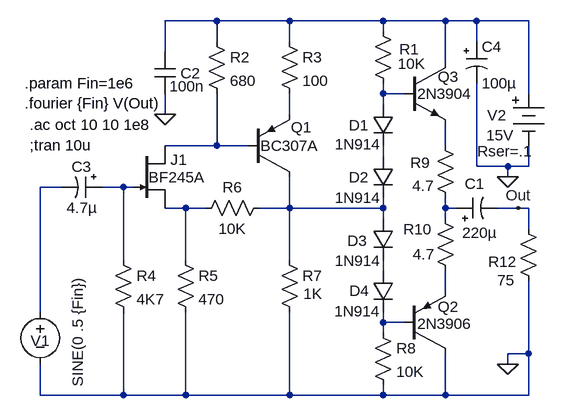
[diagram p0: schematic PwrVidAmp.asc]
PwrVidAmp.asc, the LTspice schematic file:
Version 4
SHEET 1 880 680
WIRE -272 480 -272 288
WIRE -272 608 -272 560
WIRE -240 288 -272 288
WIRE -144 288 -176 288
WIRE -144 400 -144 288
WIRE -144 608 -272 608
WIRE -144 608 -144 480
WIRE -128 288 -144 288
WIRE -80 80 -80 32
WIRE -80 176 -80 144
WIRE -48 320 -80 320
WIRE -48 400 -48 320
WIRE -48 608 -144 608
WIRE -48 608 -48 480
WIRE -16 320 -48 320
WIRE 0 32 -80 32
WIRE 0 64 0 32
WIRE 0 224 -80 224
WIRE 0 224 0 144
WIRE 48 224 0 224
WIRE 112 32 0 32
WIRE 112 64 112 32
WIRE 112 176 112 144
WIRE 112 320 64 320
WIRE 112 320 112 272
WIRE 112 400 112 320
WIRE 112 608 -48 608
WIRE 112 608 112 480
WIRE 256 32 112 32
WIRE 256 48 256 32
WIRE 256 144 256 128
WIRE 256 160 256 144
WIRE 256 240 256 224
WIRE 256 320 112 320
WIRE 256 320 256 304
WIRE 256 336 256 320
WIRE 256 416 256 400
WIRE 256 496 256 480
WIRE 256 512 256 496
WIRE 256 608 112 608
WIRE 256 608 256 592
WIRE 288 144 256 144
WIRE 288 496 256 496
WIRE 352 32 256 32
WIRE 352 96 352 32
WIRE 352 224 352 192
WIRE 352 320 352 304
WIRE 352 336 352 320
WIRE 352 448 352 416
WIRE 352 608 256 608
WIRE 352 608 352 544
WIRE 368 320 352 320
WIRE 400 32 352 32
WIRE 400 64 400 32
WIRE 400 256 400 128
WIRE 448 256 400 256
WIRE 448 272 448 256
WIRE 448 560 448 544
WIRE 464 320 432 320
WIRE 480 32 400 32
WIRE 480 144 480 32
WIRE 480 256 448 256
WIRE 480 256 480 224
WIRE 480 320 464 320
WIRE 480 352 480 320
WIRE 480 544 448 544
WIRE 480 544 480 432
WIRE 480 608 352 608
WIRE 480 608 480 544
FLAG 448 560 0
FLAG -80 176 0
FLAG 464 320 Out
FLAG 448 272 0
SYMBOL njf -128 224 R0
WINDOW 0 57 22 Left 0
WINDOW 3 23 49 Left 0
SYMATTR InstName J1
SYMATTR Value BF245A
SYMBOL pnp2 48 272 M180
WINDOW 0 66 76 Left 0
WINDOW 3 19 48 Left 0
SYMATTR InstName Q1
SYMATTR Value BC307A
SYMBOL pnp2 288 544 M180
WINDOW 0 52 72 Left 0
WINDOW 3 21 46 Left 0
SYMATTR InstName Q2
SYMATTR Value 2N3906
SYMBOL npn2 288 96 R0
WINDOW 0 52 22 Left 0
WINDOW 3 21 48 Left 0
SYMATTR InstName Q3
SYMATTR Value 2N3904
SYMBOL diode 240 160 R0
WINDOW 0 -37 33 Left 0
WINDOW 3 -58 62 Left 0
SYMATTR InstName D1
SYMATTR Value 1N914
SYMBOL res 240 32 R0
WINDOW 0 41 44 Left 0
WINDOW 3 39 66 Left 0
SYMATTR InstName R1
SYMATTR Value 10K
SYMATTR SpiceLine tol=1 pwr=0.1
SYMBOL res -16 48 R0
SYMATTR InstName R2
SYMATTR Value 680
SYMATTR SpiceLine tol=1 pwr=0.1
SYMBOL res 96 48 R0
SYMATTR InstName R3
SYMATTR Value 100
SYMATTR SpiceLine tol=1 pwr=0.1
SYMBOL res -160 384 R0
SYMATTR InstName R4
SYMATTR Value 4K7
SYMATTR SpiceLine tol=1 pwr=0.1
SYMBOL res -64 384 R0
SYMATTR InstName R5
SYMATTR Value 470
SYMATTR SpiceLine tol=1 pwr=0.1
SYMBOL res 80 304 R90
WINDOW 0 0 56 VBottom 0
WINDOW 3 32 56 VTop 0
SYMATTR InstName R6
SYMATTR Value 10K
SYMATTR SpiceLine tol=1 pwr=0.1
SYMBOL res 96 384 R0
WINDOW 3 37 68 Left 0
SYMATTR Value 1K
SYMATTR InstName R7
SYMATTR SpiceLine tol=1 pwr=0.1
SYMBOL res 240 496 R0
SYMATTR InstName R8
SYMATTR Value 10K
SYMATTR SpiceLine tol=1 pwr=0.1
SYMBOL res 336 208 R0
WINDOW 0 -38 42 Left 0
WINDOW 3 -35 78 Left 0
SYMATTR InstName R9
SYMATTR Value 4.7
SYMATTR SpiceLine tol=1 pwr=0.1
SYMBOL res 336 320 R0
WINDOW 0 -49 33 Left 0
WINDOW 3 -34 71 Left 0
SYMATTR InstName R10
SYMATTR Value 4.7
SYMATTR SpiceLine tol=1 pwr=0.1
SYMBOL res 464 336 R0
WINDOW 0 -46 67 Left 0
WINDOW 3 -32 95 Left 0
SYMATTR InstName R12
SYMATTR Value 75
SYMATTR SpiceLine tol=1 pwr=0.1
SYMBOL polcap 368 336 R270
WINDOW 0 53 14 VRight 0
WINDOW 3 -22 10 VRight 0
SYMATTR InstName C1
SYMATTR Value 220µ
SYMATTR Description Capacitor
SYMATTR Type cap
SYMATTR SpiceLine V=16 Irms=460m Rser=0.16 MTBF=3000 Lser=0 mfg="Nichicon" pn="UPL1C221MPH" type="Al electrolytic" ppPkg=1
SYMBOL cap -96 80 R0
WINDOW 0 40 33 Left 0
WINDOW 3 23 53 Left 0
SYMATTR InstName C2
SYMATTR Value 100n
SYMBOL polcap -176 272 R90
WINDOW 0 0 32 VBottom 0
WINDOW 3 32 32 VTop 0
SYMATTR InstName C3
SYMATTR Value 4.7µ
SYMATTR Description Capacitor
SYMATTR Type cap
SYMATTR SpiceLine V=50 Irms=170m Rser=1 MTBF=5000 Lser=0 Rpar=1e7 mfg="Nichicon" pn="UPG1H4R7MPH" type="Al electrolytic" ppPkg=1
SYMBOL diode 240 240 R0
WINDOW 0 -37 33 Left 0
WINDOW 3 -58 64 Left 0
SYMATTR InstName D2
SYMATTR Value 1N914
SYMBOL diode 240 336 R0
WINDOW 0 -39 34 Left 0
WINDOW 3 -58 65 Left 0
SYMATTR InstName D3
SYMATTR Value 1N914
SYMBOL diode 240 416 R0
WINDOW 0 -36 31 Left 0
WINDOW 3 -59 63 Left 0
SYMATTR InstName D4
SYMATTR Value 1N914
SYMBOL voltage -272 464 R0
WINDOW 0 -15 60 Left 0
WINDOW 3 58 -38 VRight 0
SYMATTR InstName V1
SYMATTR Value SINE(0 .5 {Fin})
SYMATTR Value2 AC .5
SYMATTR SpiceLine Rser=75
SYMBOL Misc\\battery 480 128 R0
WINDOW 0 -64 49 Left 0
WINDOW 3 -65 80 Left 0
WINDOW 123 0 0 Left 0
WINDOW 39 -79 105 Left 0
SYMATTR InstName V2
SYMATTR Value 15V
SYMATTR SpiceLine Rser=.1
SYMBOL polcap 384 64 R0
WINDOW 3 24 64 Left 0
SYMATTR Value 100µ
SYMATTR InstName C4
SYMATTR Description Capacitor
SYMATTR Type cap
SYMATTR SpiceLine V=25 Irms=370m Rser=0.24 MTBF=2000 Lser=0 mfg="Nichicon" pn="UPL1E101MPH" type="Al electrolytic" ppPkg=1
TEXT -296 128 Left 0 !.param Fin=1e6\n.fourier {Fin} V(Out)
TEXT -288 192 Left 0 !.ac oct 10 10 1e8\n;tran 10u

The netlist it stands for:
* PwrVidAmp.asc
J1 N005 N002 N004 BF245A
Q1 N007 N005 N006 0 BC307A
Q2 0 N011 N014 0 2N3906
Q3 N003 N008 N012 0 2N3904
D1 N008 N009 1N914
R1 N003 N008 10K tol=1 pwr=0.1
R2 N003 N005 680 tol=1 pwr=0.1
R3 N003 N006 100 tol=1 pwr=0.1
R4 N002 0 4K7 tol=1 pwr=0.1
R5 N004 0 470 tol=1 pwr=0.1
R6 N007 N004 10K tol=1 pwr=0.1
R7 N007 0 1K tol=1 pwr=0.1
R8 N011 0 10K tol=1 pwr=0.1
R9 N012 N013 4.7 tol=1 pwr=0.1
R10 N013 N014 4.7 tol=1 pwr=0.1
R12 Out 0 75 tol=1 pwr=0.1
C1 N013 Out 220µ V=16 Irms=460m Rser=0.16 MTBF=3000 Lser=0 mfg="Nichicon" pn="UPL1C221MPH" type="Al electrolytic" ppPkg=1
C2 N003 0 100n
C3 N002 N001 4.7µ V=50 Irms=170m Rser=1 MTBF=5000 Lser=0 Rpar=1e7 mfg="Nichicon" pn="UPG1H4R7MPH" type="Al electrolytic" ppPkg=1
D2 N009 N007 1N914
D3 N007 N010 1N914
D4 N010 N011 1N914
V1 N001 0 SINE(0 .5 {Fin}) AC .5 Rser=75
V2 N003 0 15V Rser=.1
C4 N003 0 100µ V=25 Irms=370m Rser=0.24 MTBF=2000 Lser=0 mfg="Nichicon" pn="UPL1E101MPH" type="Al electrolytic" ppPkg=1
.model D D
.lib standard.dio
.model NPN NPN
.model PNP PNP
.lib standard.bjt
.model NJF NJF
.model PJF PJF
.lib standard.jft
.param Fin=1e6
.fourier {Fin} V(Out)
.ac oct 10 10 1e8
;tran 10u
.backanno
.end